# Altium schematic sheet EE463_Sch.SchDoc
size A3
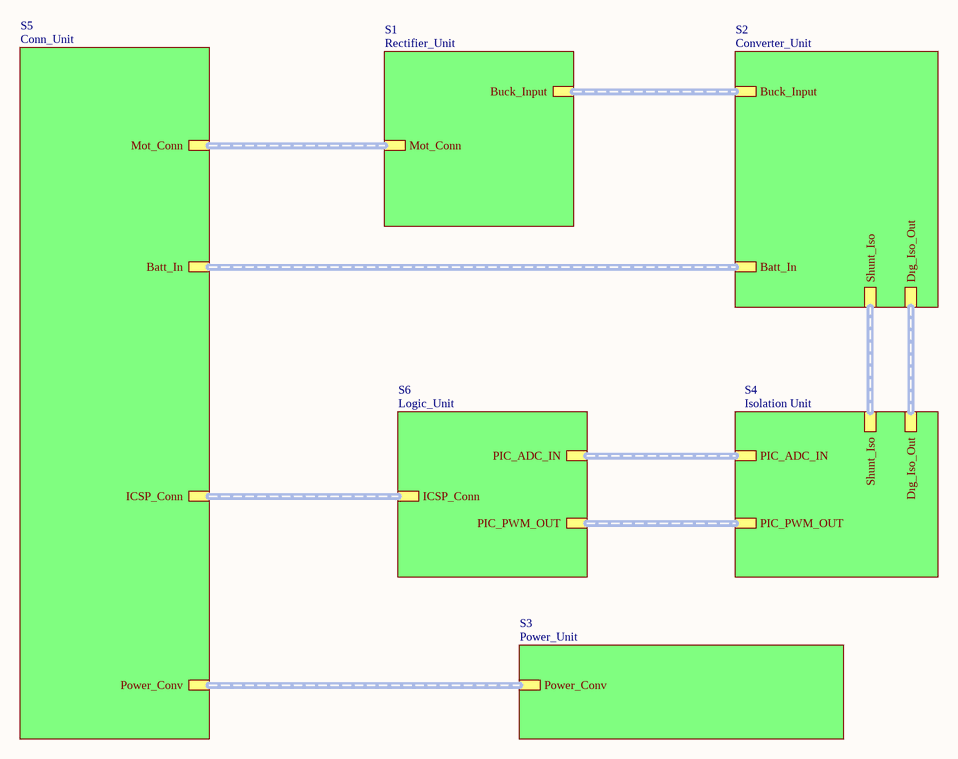
[diagram p0: EE463_Sch.SchDoc]

## Sub-sheets
S1 = Rectifier_Unit: Mot_Conn (harness Mot_Conn), Buck_Input (harness Rec_Buck)
S2 = Converter_Unit: Dıg_Iso_Out (harness DRV_In), Batt_In (harness Battery_In), Shunt_Iso (harness Shunt_Iso), Buck_Input (harness Rec_Buck)
S3 = Power_Unit: Power_Conv (harness Power_Conv)
S4 = Isolation Unit: Dıg_Iso_Out (harness DRV_In), PIC_ADC_IN (harness PIC_AN_IN), PIC_PWM_OUT (harness DIG_ISO_IN), Shunt_Iso (harness Shunt_Iso)
S5 = Conn_Unit: Mot_Conn (harness Mot_Conn), Batt_In (harness Battery_In), Power_Conv (harness Power_Conv), ICSP_Conn (harness ICSP_Conn)
S6 = Logic_Unit: PIC_ADC_IN (harness PIC_AN_IN), PIC_PWM_OUT (harness DIG_ISO_IN), ICSP_Conn (harness ICSP_Conn)

## Buses and harness runs
harness sheet S1/Buck_Input = sheet S2/Buck_Input
harness sheet S1/Mot_Conn = sheet S5/Mot_Conn
harness sheet S2/Batt_In = sheet S5/Batt_In
harness sheet S2/Dıg_Iso_Out = sheet S4/Dıg_Iso_Out
harness sheet S2/Shunt_Iso = sheet S4/Shunt_Iso
harness sheet S3/Power_Conv = sheet S5/Power_Conv
harness sheet S4/PIC_ADC_IN = sheet S6/PIC_ADC_IN
harness sheet S4/PIC_PWM_OUT = sheet S6/PIC_PWM_OUT
harness sheet S5/ICSP_Conn = sheet S6/ICSP_Conn

## Notes on the sheet
- Title
- Size:
- Date:
- A3
- Number:
- Time:
- Revision:
- Sheet
- of
- File: